# Altium project WiWi_USBStick.PrjPcb (part 5 of 5)
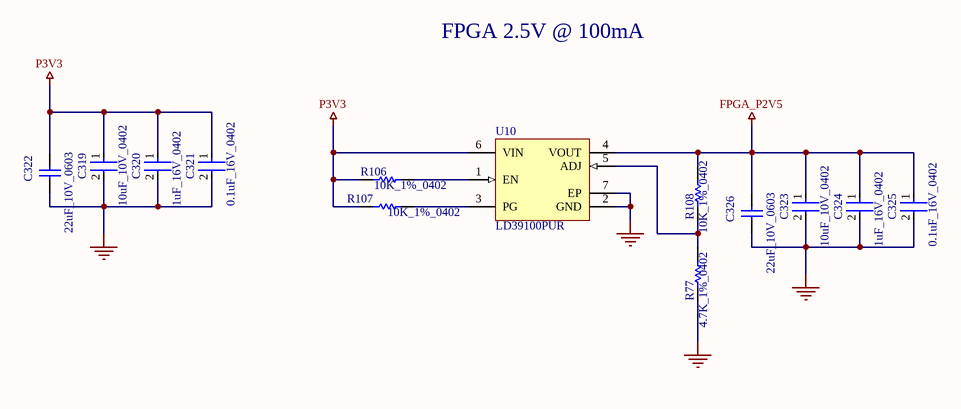
[diagram p14: 12-FPGA_Power.SchDoc]

## Nets that join several sheets
DPLL_VDD_CLKA: 14-DPLL_1 (U4.G3), 15-DPLL_2 (C238.1 C239.1 L38.2)
DPLL_VDD_CLKB: 14-DPLL_1 (U4.H3), 15-DPLL_2 (C219.1 C220.1 L33.2)
DPLL_VDD_DCO_Q01: 14-DPLL_1 (U4.D9), 15-DPLL_2 (C179.1 C180.1 L27.2)
DPLL_VDD_DCO_Q8: 14-DPLL_1 (U4.D7), 15-DPLL_2 (C181.1 C182.1 L28.2)
DPLL_VDD_DCO_Q9: 14-DPLL_1 (U4.F9), 15-DPLL_2 (C215.1 C216.1 L32.2)
DPLL_VDD_DCO_Q10: 14-DPLL_1 (U4.G9), 15-DPLL_2 (C230.1 C231.1 L37.2)
DPLL_VDD_DCO_Q11: 14-DPLL_1 (U4.J7), 15-DPLL_2 (C240.1 C241.1 L40.2)
DPLL_VDD_DCO_Q23: 14-DPLL_1 (U4.D8), 15-DPLL_2 (C213.1 C214.1 L31.2)
DPLL_VDD_DCO_Q45: 14-DPLL_1 (U4.J8), 15-DPLL_2 (C136.1 C137.1 L22.2)
DPLL_VDD_DCO_Q67: 14-DPLL_1 (U4.J9), 15-DPLL_2 (C161.1 C162.1 L25.2)
DPLL_VDD_DIA_A: 14-DPLL_1 (U4.F7), 15-DPLL_2 (C123.1 C124.1 L21.2)
DPLL_VDD_DIA_B: 14-DPLL_1 (U4.G7), 15-DPLL_2 (C159.1 C160.1 L24.2)
DPLL_VDD_DIG: 14-DPLL_1 (U4.G5 U4.H5), 15-DPLL_2 (5 pins)
DPLL_VDD_GPIO: 14-DPLL_1 (U4.J4), 15-DPLL_2 (5 pins)
DPLL_VDDA_BG_LC: 14-DPLL_1 (U4.J5 U4.K4), 15-DPLL_2 (C145.1 C146.1 C147.1 L20.2)
DPLL_VDDA_FB: 14-DPLL_1 (U4.E5), 15-DPLL_2 (C228.1 C229.1 L36.2)
DPLL_VDDA_PDCP_XTAL: 14-DPLL_1 (U4.D4 U4.E4), 15-DPLL_2 (C171.1 C177.1 L26.2)
DPLL_VDDO_Q0: 14-DPLL_1 (U4.C8), 15-DPLL_2 (C211.1 C212.1 L30.2)
DPLL_VDDO_Q1: 14-DPLL_1 (U4.C9), 15-DPLL_2 (C232.1 C233.1 L35.2)
DPLL_VDDO_Q2: 14-DPLL_1 (U4.C11), 15-DPLL_2 (C242.1 C243.1 L39.2)
DPLL_VDDO_Q3: 14-DPLL_1 (U4.C12), 15-DPLL_2 (C252.1 C253.1 L42.2)
DPLL_VDDO_Q4: 14-DPLL_1 (U4.K12), 15-DPLL_2 (C107.1 C122.1 L16.2)
DPLL_VDDO_Q5: 14-DPLL_1 (U4.K11), 15-DPLL_2 (C163.1 C164.1 L23.2)
DPLL_VDDO_Q6: 14-DPLL_1 (U4.K9), 15-DPLL_2 (C206.1 C207.1 L29.2)
DPLL_VDDO_Q7: 14-DPLL_1 (U4.K8), 15-DPLL_2 (C224.1 C225.1 L34.2)
DPLL_VDDO_Q8: 14-DPLL_1 (U4.C6), 15-DPLL_2 (C248.1 C249.1 L41.2)
DPLL_VDDO_Q9: 14-DPLL_1 (U4.E10), 15-DPLL_2 (C256.1 C257.1 L43.2)
DPLL_VDDO_Q10: 14-DPLL_1 (U4.H10), 15-DPLL_2 (C264.1 C265.1 L45.2)
DPLL_VDDO_Q11: 14-DPLL_1 (U4.K6), 15-DPLL_2 (C262.1 C263.1 L44.2)
FPGA_P2V5: 17-ECP5_FPGA_2 (14 pins), 12-FPGA_Power (6 pins)
FPGA_VCC: 17-ECP5_FPGA_2 (15 pins), 11-Power (5 pins)
GND: 01-Antennas (29 pins), 02-USB3 (21 pins), 03-FT601 (35 pins), 04-USB2_Hub_BoardControlPeripherals (51 pins), 04-AT86RF215IQ (39 pins), 06-SX1276 (31 pins), 07-TCXO_Crystal (6 pins), 13-ESP32C6 (36 pins), 14-DPLL_1 (57 pins), 15-DPLL_2 (116 pins), 16-ECP5_FPGA_1 (7 pins), 17-ECP5_FPGA_2 (59 pins), 11-Power (33 pins), 12-FPGA_Power (11 pins)
P1V8: 15-DPLL_2 (36 pins), 11-Power (5 pins)
P3V3: 02-USB3 (9 pins), 03-FT601 (20 pins), 04-USB2_Hub_BoardControlPeripherals (43 pins), 04-AT86RF215IQ (7 pins), 06-SX1276 (16 pins), 07-TCXO_Crystal (C27.2 FB2.2), 13-ESP32C6 (17 pins), 14-DPLL_1 (11 pins), 15-DPLL_2 (42 pins), 16-ECP5_FPGA_1 (C184.1 D1.2 U15.1), 17-ECP5_FPGA_2 (27 pins), 11-Power (9 pins), 12-FPGA_Power (7 pins)
USB_VBUS: 02-USB3 (11 pins), 03-FT601 (C121.2 R116.1), 11-Power (21 pins)
AT86_SPI_CS_N: 04-USB2_Hub_BoardControlPeripherals (U25.3), 04-AT86RF215IQ (R12.1)
BOARD_RESET_N: 04-USB2_Hub_BoardControlPeripherals (U23.5), 04-AT86RF215IQ (R19.1), 06-SX1276 (U12.7), 16-ECP5_FPGA_1 (U11.P12)
DPLL_CLKIN_1_N: 14-DPLL_1 (U4.C2), 16-ECP5_FPGA_1 (U11.A2)
DPLL_CLKIN_2_N: 14-DPLL_1 (U4.D2), 16-ECP5_FPGA_1 (U11.A3)
DPLL_CLKIN_2_P: 14-DPLL_1 (U4.D1), 16-ECP5_FPGA_1 (U11.C4)
DPLL_CLKIN_3_N: 14-DPLL_1 (U4.E2), 16-ECP5_FPGA_1 (U11.B3)
DPLL_CLKIN_3_P: 14-DPLL_1 (U4.E1), 16-ECP5_FPGA_1 (U11.D4)
DPLL_CLKIN_7_N: 02-USB3 (U17.2 U17.3), 14-DPLL_1 (U4.J2)
DPLL_CLKOUT0_P: 14-DPLL_1 (U4.A8), 16-ECP5_FPGA_1 (R111.1)
DPLL_CLKOUT1_P: 13-ESP32C6 (R137.1), 14-DPLL_1 (U4.A9)
DPLL_CLKOUT2_P: 14-DPLL_1 (U4.A11), 16-ECP5_FPGA_1 (R145.1)
DPLL_CLKOUT3_P: 04-AT86RF215IQ (R6.1), 14-DPLL_1 (U4.A12)
DPLL_CLKOUT4_P: 06-SX1276 (U12.5), 14-DPLL_1 (U4.M12)
DPLL_CLKOUT5_P: 14-DPLL_1 (U4.M11), 16-ECP5_FPGA_1 (R147.1)
DPLL_CLKOUT6_P: 02-USB3 (U17.1 U17.4), 14-DPLL_1 (U4.M9)
DPLL_GPIO4: 14-DPLL_1 (U4.B10), 16-ECP5_FPGA_1 (U11.A10)
DPLL_GPIO5: 14-DPLL_1 (U4.D11), 16-ECP5_FPGA_1 (U11.B10)
DPLL_GPIO10_CLK14: 14-DPLL_1 (U4.M5), 16-ECP5_FPGA_1 (U11.C10)
DPLL_OSCI: 14-DPLL_1 (U4.B4), 15-DPLL_2 (C271.2)
DPLL_XO: 07-TCXO_Crystal (R20.2 R22.2), 14-DPLL_1 (U4.A1)
ESP1_BOOT: 04-USB2_Hub_BoardControlPeripherals (U24.1), 13-ESP32C6 (C310.1 R135.1 SW1.2 U28.15)
ESP1_FPGA_SPARE1: 13-ESP32C6 (U28.31), 16-ECP5_FPGA_1 (U11.A5)
ESP1_FPGA_SPARE2: 13-ESP32C6 (U28.33), 16-ECP5_FPGA_1 (U11.A9)
ESP1_FPGA_SPARE4: 13-ESP32C6 (U28.36), 16-ECP5_FPGA_1 (U11.A8)
ESP1_FPGA_SPARE5: 13-ESP32C6 (U28.35), 16-ECP5_FPGA_1 (U11.A7)
ESP1_RST: 04-USB2_Hub_BoardControlPeripherals (U24.2), 13-ESP32C6 (C312.1 R136.1 SW2.2 U28.4)
FIFO_BE_0: 03-FT601 (U18.4), 16-ECP5_FPGA_1 (U11.K15)
FIFO_BE_1: 03-FT601 (U18.5), 16-ECP5_FPGA_1 (U11.J14)
FIFO_BE_2: 03-FT601 (U18.6), 16-ECP5_FPGA_1 (U11.J15)
FIFO_BE_3: 03-FT601 (U18.7), 16-ECP5_FPGA_1 (U11.C16)
FIFO_CLK: 03-FT601 (R115.2), 16-ECP5_FPGA_1 (U11.L16)
FIFO_D0: 03-FT601 (U18.40), 16-ECP5_FPGA_1 (U11.B16)
FIFO_D1: 03-FT601 (U18.41), 16-ECP5_FPGA_1 (U11.D16)
FIFO_D2: 03-FT601 (U18.42), 16-ECP5_FPGA_1 (U11.K16)
FIFO_D3: 03-FT601 (U18.43), 16-ECP5_FPGA_1 (U11.E16)
FIFO_D4: 03-FT601 (U18.44), 16-ECP5_FPGA_1 (U11.M15)
FIFO_D5: 03-FT601 (U18.45), 16-ECP5_FPGA_1 (U11.M14)
FIFO_D6: 03-FT601 (U18.46), 16-ECP5_FPGA_1 (U11.J16)
FIFO_D7: 03-FT601 (U18.47), 16-ECP5_FPGA_1 (U11.N16)
FIFO_D8: 03-FT601 (U18.50), 16-ECP5_FPGA_1 (U11.P16)
FIFO_D9: 03-FT601 (U18.51), 16-ECP5_FPGA_1 (U11.M12)
FIFO_D10: 03-FT601 (U18.52), 16-ECP5_FPGA_1 (U11.N13)
FIFO_D11: 03-FT601 (U18.53), 16-ECP5_FPGA_1 (U11.P13)
FIFO_D12: 03-FT601 (U18.54), 16-ECP5_FPGA_1 (U11.R15)
FIFO_D13: 03-FT601 (U18.55), 16-ECP5_FPGA_1 (U11.R14)
FIFO_D14: 03-FT601 (U18.56), 16-ECP5_FPGA_1 (U11.P11)
FIFO_D15: 03-FT601 (U18.57), 16-ECP5_FPGA_1 (U11.R12)
FIFO_D16: 03-FT601 (U18.60), 16-ECP5_FPGA_1 (U11.T14)
FIFO_D17: 03-FT601 (U18.61), 16-ECP5_FPGA_1 (U11.R13)
FIFO_D18: 03-FT601 (U18.62), 16-ECP5_FPGA_1 (U11.P14)
FIFO_D19: 03-FT601 (U18.63), 16-ECP5_FPGA_1 (U11.R16)
FIFO_D20: 03-FT601 (U18.64), 16-ECP5_FPGA_1 (U11.T13)
FIFO_D21: 03-FT601 (U18.65), 16-ECP5_FPGA_1 (U11.N12)
FIFO_D22: 03-FT601 (U18.66), 16-ECP5_FPGA_1 (U11.P15)
FIFO_D23: 03-FT601 (U18.67), 16-ECP5_FPGA_1 (U11.T15)
FIFO_D24: 03-FT601 (U18.69), 16-ECP5_FPGA_1 (U11.N14)
FIFO_D25: 03-FT601 (U18.70), 16-ECP5_FPGA_1 (U11.M11)
FIFO_D26: 03-FT601 (U18.71), 16-ECP5_FPGA_1 (U11.L12)
FIFO_D27: 03-FT601 (U18.72), 16-ECP5_FPGA_1 (U11.M16)
FIFO_D28: 03-FT601 (U18.73), 16-ECP5_FPGA_1 (U11.M13)
FIFO_D29: 03-FT601 (U18.74), 16-ECP5_FPGA_1 (U11.L14)
FIFO_D30: 03-FT601 (U18.75), 16-ECP5_FPGA_1 (U11.L15)
FIFO_D31: 03-FT601 (U18.76), 16-ECP5_FPGA_1 (U11.K14)
FIFO_D_N: 03-FT601 (U18.25), 04-USB2_Hub_BoardControlPeripherals (U19.1)
FIFO_D_P: 03-FT601 (U18.23), 04-USB2_Hub_BoardControlPeripherals (U19.2)
FIFO_OE_N: 03-FT601 (U18.13), 16-ECP5_FPGA_1 (U11.F16)
FIFO_RD_N: 03-FT601 (U18.12), 16-ECP5_FPGA_1 (U11.G15)
FIFO_RXF_N: 03-FT601 (U18.9), 16-ECP5_FPGA_1 (U11.H15)
FIFO_TXE_N: 03-FT601 (U18.8), 16-ECP5_FPGA_1 (U11.H14)
FIFO_WR_N: 03-FT601 (U18.11), 16-ECP5_FPGA_1 (U11.G14)
FPGA_CFG_SPI_CS_N: 04-USB2_Hub_BoardControlPeripherals (U23.2), 16-ECP5_FPGA_1 (U11.R8)
FPGA_CFG_SPI_MISO: 04-USB2_Hub_BoardControlPeripherals (U23.10), 16-ECP5_FPGA_1 (U11.T7)
FPGA_CFG_SPI_MOSI: 04-USB2_Hub_BoardControlPeripherals (U23.6), 16-ECP5_FPGA_1 (U11.T8)
FPGA_CFG_SPI_SCK: 04-USB2_Hub_BoardControlPeripherals (U23.8), 17-ECP5_FPGA_2 (R117.1 U11.N9)
FPGA_DONE: 04-USB2_Hub_BoardControlPeripherals (U23.7), 17-ECP5_FPGA_2 (P6.2 R151.1 U11.P9)
FPGA_INITN: 04-USB2_Hub_BoardControlPeripherals (U23.4), 17-ECP5_FPGA_2 (P6.4 R152.1 U11.T9)
FPGA_PROGRAMN: 04-USB2_Hub_BoardControlPeripherals (U23.3), 17-ECP5_FPGA_2 (P6.6 R153.1 U11.R9)
LORA_SPI_CS_N: 04-USB2_Hub_BoardControlPeripherals (U25.2), 06-SX1276 (R50.2)
RADIO_SPI_MISO: 04-USB2_Hub_BoardControlPeripherals (U25.10), 04-AT86RF215IQ (R14.1), 06-SX1276 (R48.2)
RADIO_SPI_MOSI: 04-USB2_Hub_BoardControlPeripherals (U25.6), 04-AT86RF215IQ (R13.1), 06-SX1276 (R46.2)
RADIO_SPI_SCK: 04-USB2_Hub_BoardControlPeripherals (U25.8), 04-AT86RF215IQ (R11.1), 06-SX1276 (R32.2)
SDR_RX_SUBG_N: 04-AT86RF215IQ (R9.1 U1.30), 16-ECP5_FPGA_1 (U11.G2)
SDR_RX_SUBG_P: 04-AT86RF215IQ (R9.2 U1.31), 16-ECP5_FPGA_1 (U11.F1)
SDR_RX_WIFI_N: 04-AT86RF215IQ (R10.1 U1.35), 16-ECP5_FPGA_1 (U11.C2)
SDR_RX_WIFI_P: 04-AT86RF215IQ (R10.2 U1.36), 16-ECP5_FPGA_1 (U11.C1)
SDR_RXCLK_N: 04-AT86RF215IQ (R4.1 U1.34), 16-ECP5_FPGA_1 (U11.L2)
SDR_RXCLK_P: 04-AT86RF215IQ (R4.2 U1.33), 16-ECP5_FPGA_1 (U11.L1)
SDR_TX_N: 04-AT86RF215IQ (R7.1 U1.27), 16-ECP5_FPGA_1 (U11.D1)
SDR_TX_P: 04-AT86RF215IQ (R7.2 U1.28), 16-ECP5_FPGA_1 (U11.E2)
SDR_TXCLK_N: 04-AT86RF215IQ (R5.1 U1.25), 16-ECP5_FPGA_1 (U11.P2)
SDR_TXCLK_P: 04-AT86RF215IQ (R5.2 U1.26), 16-ECP5_FPGA_1 (U11.N1)
SX1276_DIO0: 06-SX1276 (R23.1), 14-DPLL_1 (U4.B2), 16-ECP5_FPGA_1 (U11.B4)
SX1276_HF_TXRX_CTRL: 04-USB2_Hub_BoardControlPeripherals (U25.5), 06-SX1276 (R62.1 U22.4)
SX1276_HFLF_CTRL: 04-USB2_Hub_BoardControlPeripherals (U25.7), 06-SX1276 (R60.1 U20.4)
SX1276_LF_TXRX_CTRL: 04-USB2_Hub_BoardControlPeripherals (U25.4), 06-SX1276 (R61.1 U21.4)
USB2_D_N: 02-USB3 (J2.A7 J2.B7), 04-USB2_Hub_BoardControlPeripherals (U19.30)
USB2_D_P: 02-USB3 (J2.A6 J2.B6), 04-USB2_Hub_BoardControlPeripherals (U19.31)
USB3_RX_N: 02-USB3 (U16.4), 03-FT601 (U18.34)
USB3_RX_P: 02-USB3 (U16.3), 03-FT601 (U18.35)
USB3_TX_N: 02-USB3 (C73.1), 03-FT601 (U18.31)
USB3_TX_P: 02-USB3 (C72.1), 03-FT601 (U18.32)
USB_DPLL_RST: 04-USB2_Hub_BoardControlPeripherals (U24.6), 14-DPLL_1 (R25.1)
USB_I2C_SCL: 04-USB2_Hub_BoardControlPeripherals (R131.1 U24.9), 14-DPLL_1 (U4.K2)
USB_I2C_SDA: 04-USB2_Hub_BoardControlPeripherals (R132.1 U24.8), 14-DPLL_1 (U4.L2)
USB_UART_RX: 04-USB2_Hub_BoardControlPeripherals (U24.4), 13-ESP32C6 (R140.1)
USB_UART_TX: 04-USB2_Hub_BoardControlPeripherals (U24.5), 13-ESP32C6 (R143.1)
WIWI1_DIPLEX1_SUBG: 01-Antennas (U6.6), 04-AT86RF215IQ (C20.2)
WIWI1_DIPLEX1_WIFI: 01-Antennas (U6.4), 13-ESP32C6 (C329.2 R154.2)
WIWI1_DIPLEX2_SUBG: 01-Antennas (U7.6), 06-SX1276 (U20.5)
WIWI1_DIPLEX2_WIFI: 01-Antennas (U7.4), 04-AT86RF215IQ (C21.1)

## Assembly variants
845-XXXXX_PCBA_projectname: all parts fitted